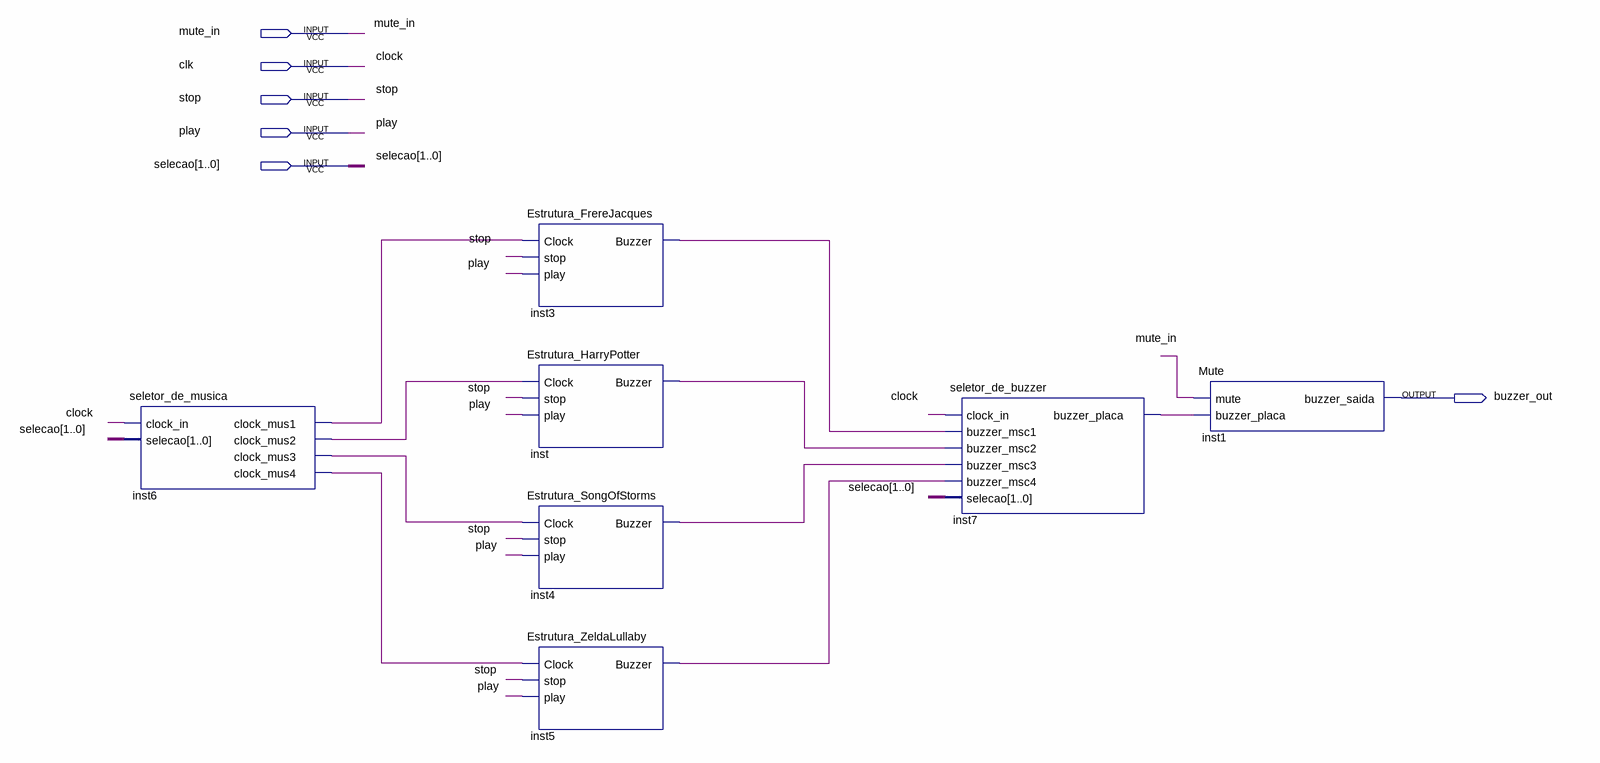
[diagram p0: schematic sheet]
// Quartus schematic bloco_selecao_musica.bdf as structural Verilog: 7 symbols, 6 pins
module bloco_selecao_musica (
  input  mute_in,
  input  clk,
  input  stop,
  input  play,
  input  [1:0] selecao,
  output buzzer_out
);

  wire inst3_buzzer, inst4_buzzer, inst5_buzzer, inst6_clock_mus1, inst6_clock_mus2, inst6_clock_mus3,
       inst6_clock_mus4, inst7_buzzer_placa, inst_buzzer;

  seletor_de_musica inst6 (
    .clock_in(clk), .selecao(selecao), .clock_mus1(inst6_clock_mus1), .clock_mus2(inst6_clock_mus2),
    .clock_mus3(inst6_clock_mus3), .clock_mus4(inst6_clock_mus4));
  Estrutura_FrereJacques inst3 (.Clock(inst6_clock_mus1), .stop(stop), .play(play), .Buzzer(inst3_buzzer));
  Estrutura_HarryPotter inst (.Clock(inst6_clock_mus2), .stop(stop), .play(play), .Buzzer(inst_buzzer));
  Estrutura_SongOfStorms inst4 (.Clock(inst6_clock_mus3), .stop(stop), .play(play), .Buzzer(inst4_buzzer));
  Estrutura_ZeldaLullaby inst5 (.Clock(inst6_clock_mus4), .stop(stop), .play(play), .Buzzer(inst5_buzzer));
  seletor_de_buzzer inst7 (
    .clock_in(clk), .buzzer_msc1(inst3_buzzer), .buzzer_msc2(inst_buzzer), .buzzer_msc3(inst4_buzzer),
    .buzzer_msc4(inst5_buzzer), .selecao(selecao), .buzzer_placa(inst7_buzzer_placa));
  Mute inst1 (.mute(mute_in), .buzzer_placa(inst7_buzzer_placa), .buzzer_saida(buzzer_out));

  // Other names for the same wires on the sheet: clock = clk
endmodule
